# EAGLE design Start Line (EAGLE 9.6.2)
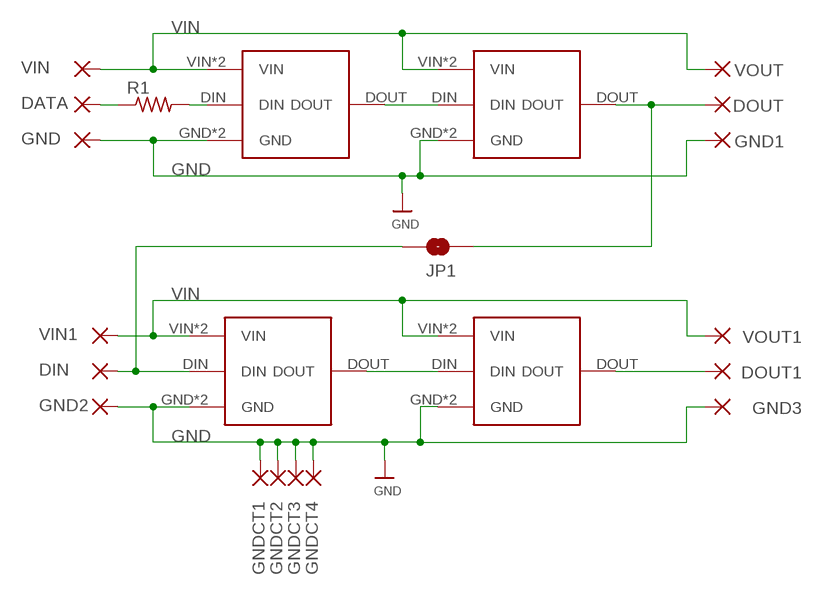
[diagram p0: schematic, sheet 1]

## Parts
DATA  SMD5  [SMD2,54-5,08]
DIN  SMD5  [SMD2,54-5,08]
DOUT  SMD5  [SMD2,54-5,08]
DOUT1  SMD5  [SMD2,54-5,08]
GND  SMD5  [SMD2,54-5,08]
GND1  SMD5  [SMD2,54-5,08]
GND2  SMD5  [SMD2,54-5,08]
GND3  SMD5  [SMD2,54-5,08]
GNDCT1  SMD5  [SMD5,5X5]
GNDCT2  SMD5  [SMD5,5X5]
GNDCT3  SMD5  [SMD5,5X5]
GNDCT4  SMD5  [SMD5,5X5]
JP1  JUMPER-SMT_2_NO_SILK  [SMT-JUMPER_2_NO_SILK]
R1  R-US_R1206  [R1206]
U$1  NP-1  [NP-1]
U$3  NP-1  [NP-1]
U$5  NP-3  [NP-3]
U$8  NP-3  [NP-3]
VIN  SMD5  [SMD2,54-5,08]
VIN1  SMD5  [SMD2,54-5,08]
VOUT  SMD5  [SMD2,54-5,08]
VOUT1  SMD5  [SMD2,54-5,08]

## Nets
DATA: DATA.1(P) R1.1
DIN1: R1.2 U$5.DIN
DIN2: U$5.DOUT U$8.DIN
DIN3: DIN.1(P) JP1.2 U$1.DIN
DIN4: U$1.DOUT U$3.DIN
DOUT: DOUT.1(P) JP1.1 U$8.DOUT
DOUT1: DOUT1.1(P) U$3.DOUT
GND: GND1.1(P) GND2.1(P) GND3.1(P) GND.1(P) GNDCT1.1(P) GNDCT2.1(P) GNDCT3.1(P) GNDCT4.1(P) U$1.GND U$1.GND1(GND) U$3.GND U$3.GND1(GND) U$5.GND U$5.GND1(GND) U$8.GND U$8.GND1(GND)
VIN: U$1.VIN U$1.VOUT(VIN) U$3.VIN U$3.VOUT(VIN) U$5.VIN U$5.VOUT(VIN) U$8.VIN U$8.VOUT(VIN) VIN1.1(P) VIN.1(P) VOUT1.1(P) VOUT.1(P)

## Library data of the parts
DATA DIN DOUT DOUT1 GND GND1-GND3 VIN VIN1 VOUT VOUT1 = wirepad:SMD5: SMD PAD
GNDCT1-GNDCT4 = Wirepad 5x5mm:SMD5: SMD PAD
JP1 = SparkFun-Jumpers:JUMPER-SMT_2_NO: Normally open jumper This jumper has two pads in close proximity to each other. Apply solder to close the connection. Round pads are easier to solder for beginners, but are a lot larger. SparkFun Product that uses the round pads: SparkFun EL Sequencer <https://www.sparkfun.com/products/12781>
R1 = adafruit:R-US_: RESISTOR, American symbol
U$1 U$3 = Neopixel:NP-1
U$5 U$8 = Neopixel:NP-3

## Board
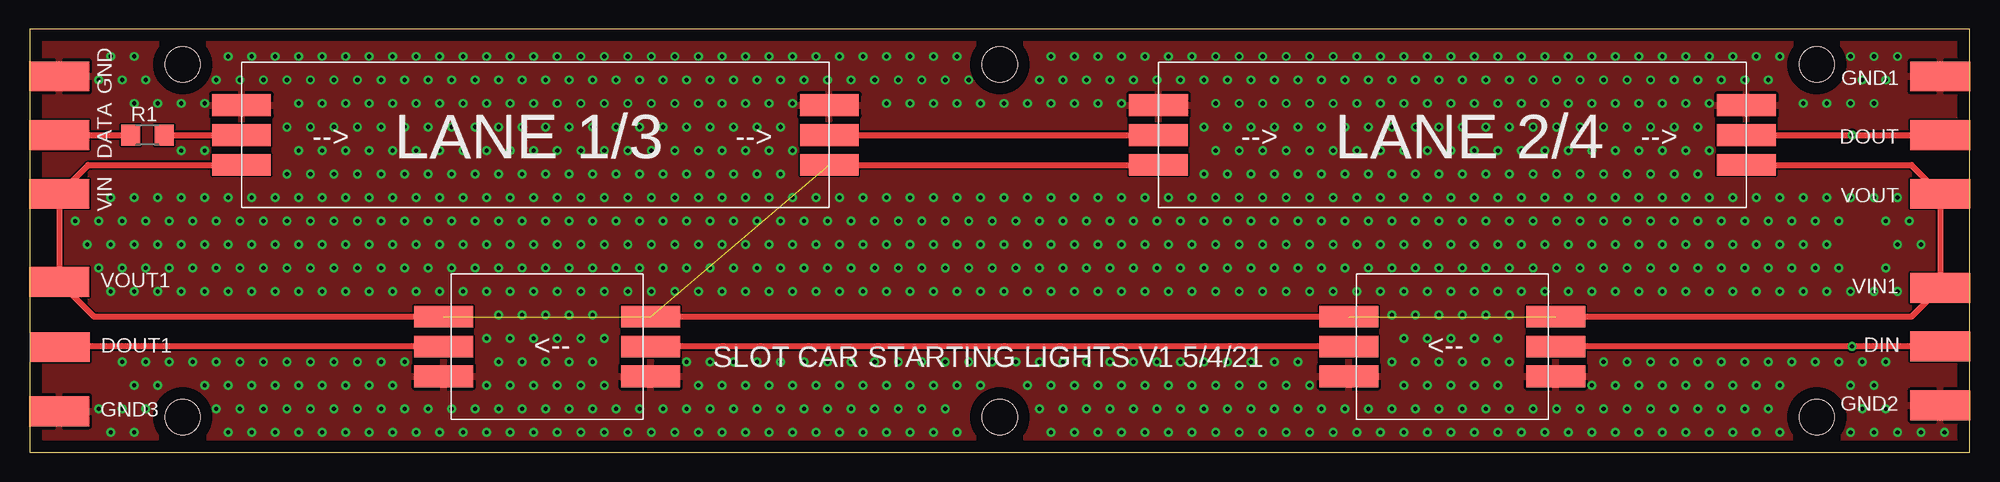
[diagram p1: board, top side]
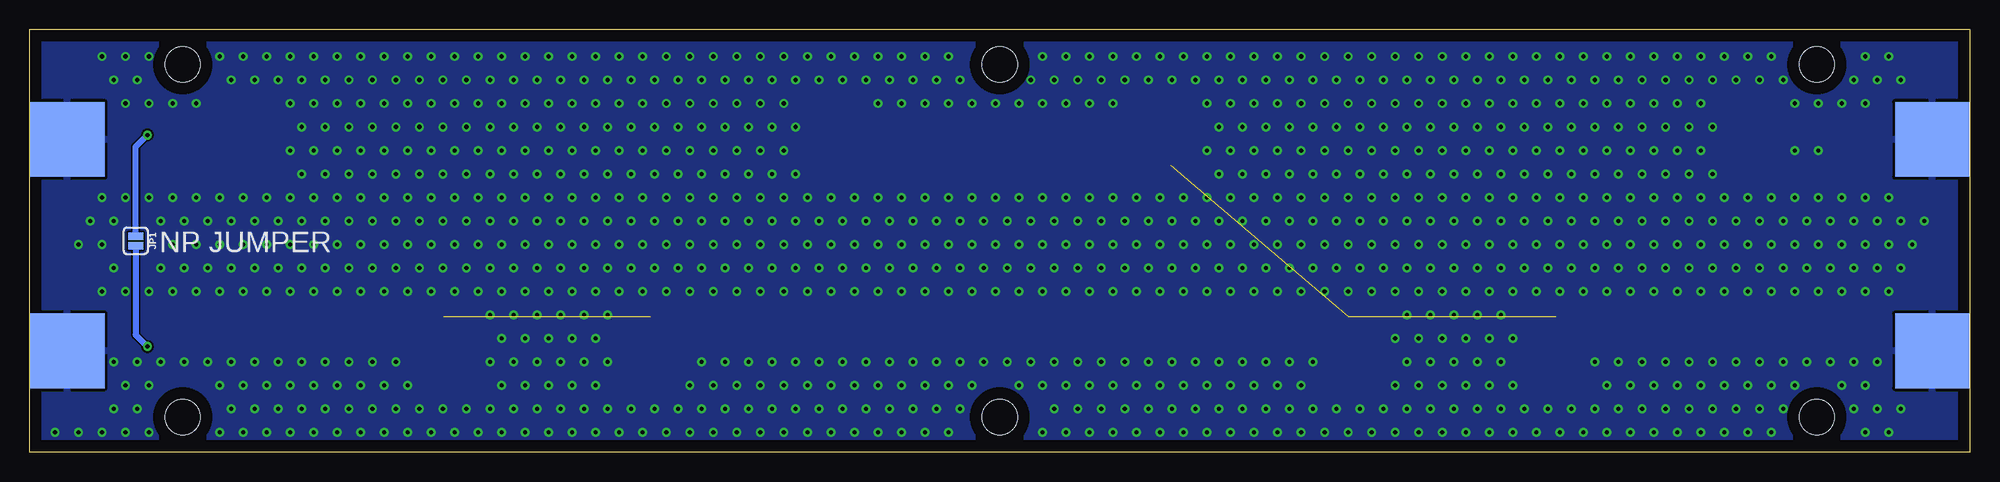
[diagram p2: board, bottom side, seen from below]

Size 165 x 36 mm. Coordinates in mm from the lower left corner, seen from the top.
Outline: 0,0 165,0 165,36 0,36 0,0
Copper layers (1*16): Top 0.035mm / dielectric 1.5mm / Bottom 0.035mm
Design rules "default": minimum track width 6mil, minimum drill 0.35mm, track to track 6mil, track to pad 6mil, pad to pad 6mil, via to via 6mil, smd to smd 6mil, copper to edge 40mil, drill to drill 6mil, minimum pad ring 10mil, minimum via ring 8mil, stop-mask expansion 4mil, vias tented up to drill 0.5mm, thermal gap 10mil
Holes 3 mm at 13,33 13,3 152,33 152,3 82.5,33 82.5,3

### Footprints (pad centres in the part's own frame; a part is rotated, then mirrored left to right if it is on the bottom)
SMD2,54-5,08 = smd 2.54 x 5.08: 1 0,0
SMD5,5X5 = smd 6.35 x 6.35: 1 0.635,0.635
SMT-JUMPER_2_NO_SILK = smd 0.635 x 1.27: 1 -0.406,0; 2 0.406,0
R1206 = smd 1.6 x 1.803: 1 -1.422,0; 2 1.422,0
NP-1 = smd 5 x 1.85: DIN 8.8,0; DOUT -8.8,0; GND -8.8,-2.54; GND1 8.8,-2.54; VIN -8.8,2.54; VOUT 8.8,2.54
NP-3 = smd 5 x 1.85: DIN 25,0; DOUT -25,0; GND -25,-2.54; GND1 25,-2.54; VIN -25,2.54; VOUT 25,2.54

### Placement (x,y rotation side)
DATA  2.5,27 90 top
DIN  162.5,9 270 top
DOUT  162.5,27 90 top
DOUT1  2.55,8.95 270 top
GND  2.5,32 90 top
GND1  162.5,32 90 top
GND2  162.5,4 90 top
GND3  2.5,3.5 90 top
GNDCT1  162.45,26 0 bottom
GNDCT2  3.8,26 0 bottom
GNDCT3  162.45,8 0 bottom
GNDCT4  3.8,8 0 bottom
JP1  156,18 270 bottom
R1  10,27 0 top
U$1  121,9 0 top
U$3  44,9 0 top
U$5  43,27 180 top
U$8  121,27 180 top
VIN  2.5,22 270 top
VIN1  162.5,14 90 top
VOUT  162.5,22 90 top
VOUT1  2.5,14.5 90 top

### Tracks (layer width: path | path; a pad name or v marks a point on that pad's centre or on a via)
DATA
  Top 0.508: DATA.1 R1.1
DIN1
  Top 0.508: R1.2 U$5.DIN
DIN2
  Top 0.508: U$5.DOUT U$8.DIN
DIN3  (via drill 0.35)
  Top 0.508: DIN.1 v155,9 U$1.DIN
  Bottom 0.508: JP1.2 156,10 v155,9
DIN4
  Top 0.508: U$1.DOUT U$3.DIN
DOUT  (via drill 0.35)
  Top 0.508: U$8.DOUT v155,27 DOUT.1
  Bottom 0.508: JP1.1 156,26 v155,27
DOUT1
  Top 0.508: U$3.DOUT 2.6,9 DOUT1.1
GND  (via drill 0.35)
  other vias: 4.87,17.7 3.87,19.7 6.87,1.7 5.87,3.7 6.87,13.7 5.87,15.7 6.87,17.7 5.87,19.7 6.87,21.7 5.87,31.7 6.87,33.7 8.87,1.7 7.87,3.7 8.87,5.7 7.87,7.7 8.87,13.7 7.87,15.7 8.87,17.7 7.87,19.7 8.87,21.7 8.87,29.7 7.87,31.7 8.87,33.7 9.87,3.7 10.87,5.7 9.87,7.7 10.87,13.7 9.87,15.7 10.87,17.7 9.87,19.7 10.87,21.7 10.87,29.7 9.87,31.7 11.87,7.7 12.87,13.7 11.87,15.7 12.87,17.7 11.87,19.7 12.87,21.7 12.87,25.7 12.87,29.7 14.87,5.7 13.87,7.7 14.87,13.7 13.87,15.7 14.87,17.7 13.87,19.7 14.87,21.7 14.87,25.7 14.87,29.7 16.87,1.7 15.87,3.7 16.87,5.7 15.87,7.7 16.87,13.7 15.87,15.7 16.87,17.7 15.87,19.7 16.87,21.7 15.87,31.7 16.87,33.7 18.87,1.7 17.87,3.7 18.87,5.7 17.87,7.7 18.87,13.7 17.87,15.7 18.87,17.7 17.87,19.7 18.87,21.7 17.87,31.7 18.87,33.7 20.87,1.7 19.87,3.7 20.87,5.7 19.87,7.7 20.87,13.7 19.87,15.7 20.87,17.7 19.87,19.7 20.87,21.7 19.87,31.7 20.87,33.7 22.87,1.7 21.87,3.7 22.87,5.7 21.87,7.7 22.87,13.7 21.87,15.7 22.87,17.7 21.87,19.7 22.87,21.7 21.87,23.7 22.87,25.7 21.87,27.7 22.87,29.7 21.87,31.7 22.87,33.7 24.87,1.7 23.87,3.7 24.87,5.7 23.87,7.7 24.87,13.7 23.87,15.7 24.87,17.7 23.87,19.7 24.87,21.7 23.87,23.7 24.87,25.7 23.87,27.7 24.87,29.7 23.87,31.7 24.87,33.7 26.87,1.7 25.87,3.7 26.87,5.7 25.87,7.7 26.87,13.7 25.87,15.7 26.87,17.7 25.87,19.7 26.87,21.7 25.87,23.7 26.87,25.7 25.87,27.7 26.87,29.7 25.87,31.7 26.87,33.7 28.87,1.7 27.87,3.7 28.87,5.7 27.87,7.7 28.87,13.7 27.87,15.7 28.87,17.7 27.87,19.7 28.87,21.7 27.87,23.7 28.87,25.7 27.87,27.7 28.87,29.7 27.87,31.7 28.87,33.7 30.87,1.7 29.87,3.7 30.87,5.7 29.87,7.7 30.87,13.7 29.87,15.7 30.87,17.7 29.87,19.7 30.87,21.7 29.87,23.7 30.87,25.7 29.87,27.7 30.87,29.7 29.87,31.7 30.87,33.7 32.87,1.7 31.87,3.7 31.87,7.7 32.87,13.7 31.87,15.7 32.87,17.7 31.87,19.7 32.87,21.7 31.87,23.7 32.87,25.7 31.87,27.7 32.87,29.7 31.87,31.7 32.87,33.7 34.87,1.7 33.87,3.7 34.87,13.7 33.87,15.7 34.87,17.7 33.87,19.7 34.87,21.7 33.87,23.7 34.87,25.7 33.87,27.7 34.87,29.7 33.87,31.7 34.87,33.7 36.87,1.7 35.87,3.7 36.87,13.7 35.87,15.7 36.87,17.7 35.87,19.7 36.87,21.7 35.87,23.7 36.87,25.7 35.87,27.7 36.87,29.7 35.87,31.7 36.87,33.7 38.87,1.7 37.87,3.7 38.87,5.7 38.87,9.7 38.87,13.7 37.87,15.7 38.87,17.7 37.87,19.7 38.87,21.7 37.87,23.7 38.87,25.7 37.87,27.7 38.87,29.7 37.87,31.7 38.87,33.7 40.87,1.7 39.87,3.7 40.87,5.7 39.87,7.7 40.87,9.7 39.87,11.7 40.87,13.7 39.87,15.7 40.87,17.7 39.87,19.7 40.87,21.7 39.87,23.7 40.87,25.7 39.87,27.7 40.87,29.7 39.87,31.7 40.87,33.7 42.87,1.7 41.87,3.7 42.87,5.7 41.87,7.7 42.87,9.7 41.87,11.7 42.87,13.7 41.87,15.7 42.87,17.7 41.87,19.7 42.87,21.7 41.87,23.7 42.87,25.7 41.87,27.7 42.87,29.7 41.87,31.7 42.87,33.7 44.87,1.7 43.87,3.7 44.87,5.7 43.87,7.7 44.87,9.7 43.87,11.7 44.87,13.7 43.87,15.7 44.87,17.7 43.87,19.7 44.87,21.7 43.87,23.7 44.87,25.7 43.87,27.7 44.87,29.7 43.87,31.7 44.87,33.7 46.87,1.7 45.87,3.7 46.87,5.7 45.87,7.7 46.87,9.7 45.87,11.7 46.87,13.7 45.87,15.7 46.87,17.7 45.87,19.7 46.87,21.7 45.87,23.7 46.87,25.7 45.87,27.7 46.87,29.7 45.87,31.7 46.87,33.7 48.87,1.7 47.87,3.7 48.87,5.7 47.87,7.7 48.87,9.7 47.87,11.7 48.87,13.7 47.87,15.7 48.87,17.7 47.87,19.7 48.87,21.7 47.87,23.7 48.87,25.7 47.87,27.7 48.87,29.7 47.87,31.7 48.87,33.7 50.87,1.7 49.87,3.7 50.87,13.7 49.87,15.7 50.87,17.7 49.87,19.7 50.87,21.7 49.87,23.7 50.87,25.7 49.87,27.7 50.87,29.7 49.87,31.7 50.87,33.7 52.87,1.7 51.87,3.7 52.87,13.7 51.87,15.7 52.87,17.7 51.87,19.7 52.87,21.7 51.87,23.7 52.87,25.7 51.87,27.7 52.87,29.7 51.87,31.7 52.87,33.7 54.87,1.7 53.87,3.7 54.87,13.7 53.87,15.7 54.87,17.7 53.87,19.7 54.87,21.7 53.87,23.7 54.87,25.7 53.87,27.7 54.87,29.7 53.87,31.7 54.87,33.7 56.87,1.7 55.87,3.7 56.87,5.7 55.87,7.7 56.87,13.7 55.87,15.7 56.87,17.7 55.87,19.7 56.87,21.7 55.87,23.7 56.87,25.7 55.87,27.7 56.87,29.7 55.87,31.7 56.87,33.7 58.87,1.7 57.87,3.7 58.87,5.7 57.87,7.7 58.87,13.7 57.87,15.7 58.87,17.7 57.87,19.7 58.87,21.7 57.87,23.7 58.87,25.7 57.87,27.7 58.87,29.7 57.87,31.7 58.87,33.7 60.87,1.7 59.87,3.7 60.87,5.7 59.87,7.7 60.87,13.7 59.87,15.7 60.87,17.7 59.87,19.7 60.87,21.7 59.87,23.7 60.87,25.7 59.87,27.7 60.87,29.7 59.87,31.7 60.87,33.7 62.87,1.7 61.87,3.7 62.87,5.7 61.87,7.7 62.87,13.7 61.87,15.7 62.87,17.7 61.87,19.7 62.87,21.7 61.87,23.7 62.87,25.7 61.87,27.7 62.87,29.7 61.87,31.7 62.87,33.7 64.87,1.7 63.87,3.7 64.87,5.7 63.87,7.7 64.87,13.7 63.87,15.7 64.87,17.7 63.87,19.7 64.87,21.7 63.87,23.7 64.87,25.7 63.87,27.7 64.87,29.7 63.87,31.7 64.87,33.7 66.87,1.7 65.87,3.7 66.87,5.7 65.87,7.7 66.87,13.7 65.87,15.7 66.87,17.7 65.87,19.7 66.87,21.7 65.87,31.7 66.87,33.7 68.87,1.7 67.87,3.7 68.87,5.7 67.87,7.7 68.87,13.7 67.87,15.7 68.87,17.7 67.87,19.7 68.87,21.7 67.87,31.7 68.87,33.7 70.87,1.7 69.87,3.7 70.87,5.7 69.87,7.7 70.87,13.7 69.87,15.7 70.87,17.7 69.87,19.7 70.87,21.7 69.87,31.7 70.87,33.7 72.87,1.7 71.87,3.7 72.87,5.7 71.87,7.7 72.87,13.7 71.87,15.7 72.87,17.7 71.87,19.7 72.87,21.7 72.87,29.7 71.87,31.7 72.87,33.7 74.87,1.7 73.87,3.7 74.87,5.7 73.87,7.7 74.87,13.7 73.87,15.7 74.87,17.7 73.87,19.7 74.87,21.7 74.87,29.7 73.87,31.7 74.87,33.7 76.87,1.7 75.87,3.7 76.87,5.7 75.87,7.7 76.87,13.7 75.87,15.7 76.87,17.7 75.87,19.7 76.87,21.7 76.87,29.7 75.87,31.7 76.87,33.7 78.87,1.7 77.87,3.7 78.87,5.7 77.87,7.7 78.87,13.7 77.87,15.7 78.87,17.7 77.87,19.7 78.87,21.7 78.87,29.7 77.87,31.7 78.87,33.7 80.87,5.7 79.87,7.7 80.87,13.7 79.87,15.7 80.87,17.7 79.87,19.7 80.87,21.7 80.87,29.7 79.87,31.7 81.87,7.7 82.87,13.7 81.87,15.7 82.87,17.7 81.87,19.7 82.87,21.7 82.87,29.7 84.87,5.7 83.87,7.7 84.87,13.7 83.87,15.7 84.87,17.7 83.87,19.7 84.87,21.7 84.87,29.7 86.87,1.7 85.87,3.7 86.87,5.7 85.87,7.7 86.87,13.7 85.87,15.7 86.87,17.7 85.87,19.7 86.87,21.7 86.87,29.7 85.87,31.7 86.87,33.7 88.87,1.7 87.87,3.7 88.87,5.7 87.87,7.7 88.87,13.7 87.87,15.7 88.87,17.7 87.87,19.7 88.87,21.7 88.87,29.7 87.87,31.7 88.87,33.7 90.87,1.7 89.87,3.7 90.87,5.7 89.87,7.7 90.87,13.7 89.87,15.7 90.87,17.7 89.87,19.7 90.87,21.7 90.87,29.7 89.87,31.7 90.87,33.7 92.87,1.7 91.87,3.7 92.87,5.7 91.87,7.7 92.87,13.7 91.87,15.7 92.87,17.7 91.87,19.7 92.87,21.7 92.87,29.7 91.87,31.7 92.87,33.7 94.87,1.7 93.87,3.7 94.87,5.7 93.87,7.7 94.87,13.7 93.87,15.7 94.87,17.7 93.87,19.7 94.87,21.7 93.87,31.7 94.87,33.7 96.87,1.7 95.87,3.7 96.87,5.7 95.87,7.7 96.87,13.7 95.87,15.7 96.87,17.7 95.87,19.7 96.87,21.7 95.87,31.7 96.87,33.7 98.87,1.7 97.87,3.7 98.87,5.7 97.87,7.7 98.87,13.7 97.87,15.7 98.87,17.7 97.87,19.7 98.87,21.7 97.87,31.7 98.87,33.7 100.87,1.7 99.87,3.7 100.87,5.7 99.87,7.7 100.87,13.7 99.87,15.7 100.87,17.7 99.87,19.7 100.87,21.7 99.87,23.7 100.87,25.7 99.87,27.7 100.87,29.7 99.87,31.7 100.87,33.7 102.87,1.7 101.87,3.7 102.87,5.7 101.87,7.7 102.87,13.7 101.87,15.7 102.87,17.7 101.87,19.7 102.87,21.7 101.87,23.7 102.87,25.7 101.87,27.7 102.87,29.7 101.87,31.7 102.87,33.7 104.87,1.7 103.87,3.7 104.87,5.7 103.87,7.7 104.87,13.7 103.87,15.7 104.87,17.7 103.87,19.7 104.87,21.7 103.87,23.7 104.87,25.7 103.87,27.7 104.87,29.7 103.87,31.7 104.87,33.7 106.87,1.7 105.87,3.7 106.87,5.7 105.87,7.7 106.87,13.7 105.87,15.7 106.87,17.7 105.87,19.7 106.87,21.7 105.87,23.7 106.87,25.7 105.87,27.7 106.87,29.7 105.87,31.7 106.87,33.7 108.87,1.7 107.87,3.7 108.87,5.7 107.87,7.7 108.87,13.7 107.87,15.7 108.87,17.7 107.87,19.7 108.87,21.7 107.87,23.7 108.87,25.7 107.87,27.7 108.87,29.7 107.87,31.7 108.87,33.7 110.87,1.7 109.87,3.7 110.87,13.7 109.87,15.7 110.87,17.7 109.87,19.7 110.87,21.7 109.87,23.7 110.87,25.7 109.87,27.7 110.87,29.7 109.87,31.7 110.87,33.7 112.87,1.7 111.87,3.7 112.87,13.7 111.87,15.7 112.87,17.7 111.87,19.7 112.87,21.7 111.87,23.7 112.87,25.7 111.87,27.7 112.87,29.7 111.87,31.7 112.87,33.7 114.87,1.7 113.87,3.7 114.87,13.7 113.87,15.7 114.87,17.7 113.87,19.7 114.87,21.7 113.87,23.7 114.87,25.7 113.87,27.7 114.87,29.7 113.87,31.7 114.87,33.7 116.87,1.7 115.87,3.7 116.87,5.7 115.87,7.7 116.87,9.7 115.87,11.7 116.87,13.7 115.87,15.7 116.87,17.7 115.87,19.7 116.87,21.7 115.87,23.7 116.87,25.7 115.87,27.7 116.87,29.7 115.87,31.7 116.87,33.7 118.87,1.7 117.87,3.7 118.87,5.7 117.87,7.7 118.87,9.7 117.87,11.7 118.87,13.7 117.87,15.7 118.87,17.7 117.87,19.7 118.87,21.7 117.87,23.7 118.87,25.7 117.87,27.7 118.87,29.7 117.87,31.7 118.87,33.7 120.87,1.7 119.87,3.7 120.87,5.7 119.87,7.7 120.87,9.7 119.87,11.7 120.87,13.7 119.87,15.7 120.87,17.7 119.87,19.7 120.87,21.7 119.87,23.7 120.87,25.7 119.87,27.7 120.87,29.7 119.87,31.7 120.87,33.7 122.87,1.7 121.87,3.7 122.87,5.7 121.87,7.7 122.87,9.7 121.87,11.7 122.87,13.7 121.87,15.7 122.87,17.7 121.87,19.7 122.87,21.7 121.87,23.7 122.87,25.7 121.87,27.7 122.87,29.7 121.87,31.7 122.87,33.7 124.87,1.7 123.87,3.7 124.87,5.7 123.87,7.7 124.87,9.7 123.87,11.7 124.87,13.7 123.87,15.7 124.87,17.7 123.87,19.7 124.87,21.7 123.87,23.7 124.87,25.7 123.87,27.7 124.87,29.7 123.87,31.7 124.87,33.7 126.87,1.7 125.87,3.7 125.87,7.7 125.87,11.7 126.87,13.7 125.87,15.7 126.87,17.7 125.87,19.7 126.87,21.7 125.87,23.7 126.87,25.7 125.87,27.7 126.87,29.7 125.87,31.7 126.87,33.7 128.87,1.7 127.87,3.7 128.87,13.7 127.87,15.7 128.87,17.7 127.87,19.7 128.87,21.7 127.87,23.7 128.87,25.7 127.87,27.7 128.87,29.7 127.87,31.7 128.87,33.7 130.87,1.7 129.87,3.7 130.87,13.7 129.87,15.7 130.87,17.7 129.87,19.7 130.87,21.7 129.87,23.7 130.87,25.7 129.87,27.7 130.87,29.7 129.87,31.7 130.87,33.7 132.87,1.7 131.87,3.7 132.87,5.7 132.87,13.7 131.87,15.7 132.87,17.7 131.87,19.7 132.87,21.7 131.87,23.7 132.87,25.7 131.87,27.7 132.87,29.7 131.87,31.7 132.87,33.7 134.87,1.7 133.87,3.7 134.87,5.7 133.87,7.7 134.87,13.7 133.87,15.7 134.87,17.7 133.87,19.7 134.87,21.7 133.87,23.7 134.87,25.7 133.87,27.7 134.87,29.7 133.87,31.7 134.87,33.7 136.87,1.7 135.87,3.7 136.87,5.7 135.87,7.7 136.87,13.7 135.87,15.7 136.87,17.7 135.87,19.7 136.87,21.7 135.87,23.7 136.87,25.7 135.87,27.7 136.87,29.7 135.87,31.7 136.87,33.7 138.87,1.7 137.87,3.7 138.87,5.7 137.87,7.7 138.87,13.7 137.87,15.7 138.87,17.7 137.87,19.7 138.87,21.7 137.87,23.7 138.87,25.7 137.87,27.7 138.87,29.7 137.87,31.7 138.87,33.7 140.87,1.7 139.87,3.7 140.87,5.7 139.87,7.7 140.87,13.7 139.87,15.7 140.87,17.7 139.87,19.7 140.87,21.7 139.87,23.7 140.87,25.7 139.87,27.7 140.87,29.7 139.87,31.7 140.87,33.7 142.87,1.7 141.87,3.7 142.87,5.7 141.87,7.7 142.87,13.7 141.87,15.7 142.87,17.7 141.87,19.7 142.87,21.7 141.87,23.7 142.87,25.7 141.87,27.7 142.87,29.7 141.87,31.7 142.87,33.7 144.87,1.7 143.87,3.7 144.87,5.7 143.87,7.7 144.87,13.7 143.87,15.7 144.87,17.7 143.87,19.7 144.87,21.7 143.87,31.7 144.87,33.7 146.87,1.7 145.87,3.7 146.87,5.7 145.87,7.7 146.87,13.7 145.87,15.7 146.87,17.7 145.87,19.7 146.87,21.7 145.87,31.7 146.87,33.7 148.87,1.7 147.87,3.7 148.87,5.7 147.87,7.7 148.87,13.7 147.87,15.7 148.87,17.7 147.87,19.7 148.87,21.7 147.87,31.7 148.87,33.7 149.87,7.7 150.87,13.7 149.87,15.7 150.87,17.7 149.87,19.7 150.87,21.7 150.87,29.7 151.87,7.7 152.87,13.7 151.87,15.7 152.87,17.7 151.87,19.7 152.87,21.7 152.87,29.7 154.87,1.7 154.87,5.7 153.87,7.7 154.87,13.7 153.87,15.7 153.87,19.7 154.87,21.7 154.87,29.7 154.87,33.7 156.87,1.7 155.87,3.7 156.87,5.7 155.87,7.7 156.87,13.7 156.87,21.7 156.87,29.7 155.87,31.7 156.87,33.7 158.87,1.7 157.87,3.7 157.87,7.7 158.87,13.7 157.87,15.7 158.87,17.7 157.87,19.7 158.87,21.7 157.87,31.7 158.87,33.7 160.87,1.7 160.87,17.7 159.87,19.7 162.87,1.7
  pour Bottom: 0,0 0,36 165,36 165,0
  pour Top: 0,0 0,36 165,36 165,0
VIN  (3 unrouted)
  Top 0.508: U$5.VOUT 4.96,24.46 VIN.1 VOUT1.1 5.46,11.54 U$3.VIN | U$5.VIN U$8.VOUT | U$8.VIN 160.04,24.46 VOUT.1 VIN1.1 160.04,11.54 U$1.VOUT | U$1.VIN U$3.VOUT

### Text on the board
tNames: --> | --> | --> | --> | LANE 1/3 | LANE 2/4 | <-- | <-- | SLOT CAR STARTING LIGHTS V1 5/4/21
bNames: NP JUMPER